# EAGLE schematic SmartThermo2.2 (EAGLE 8.4.0)
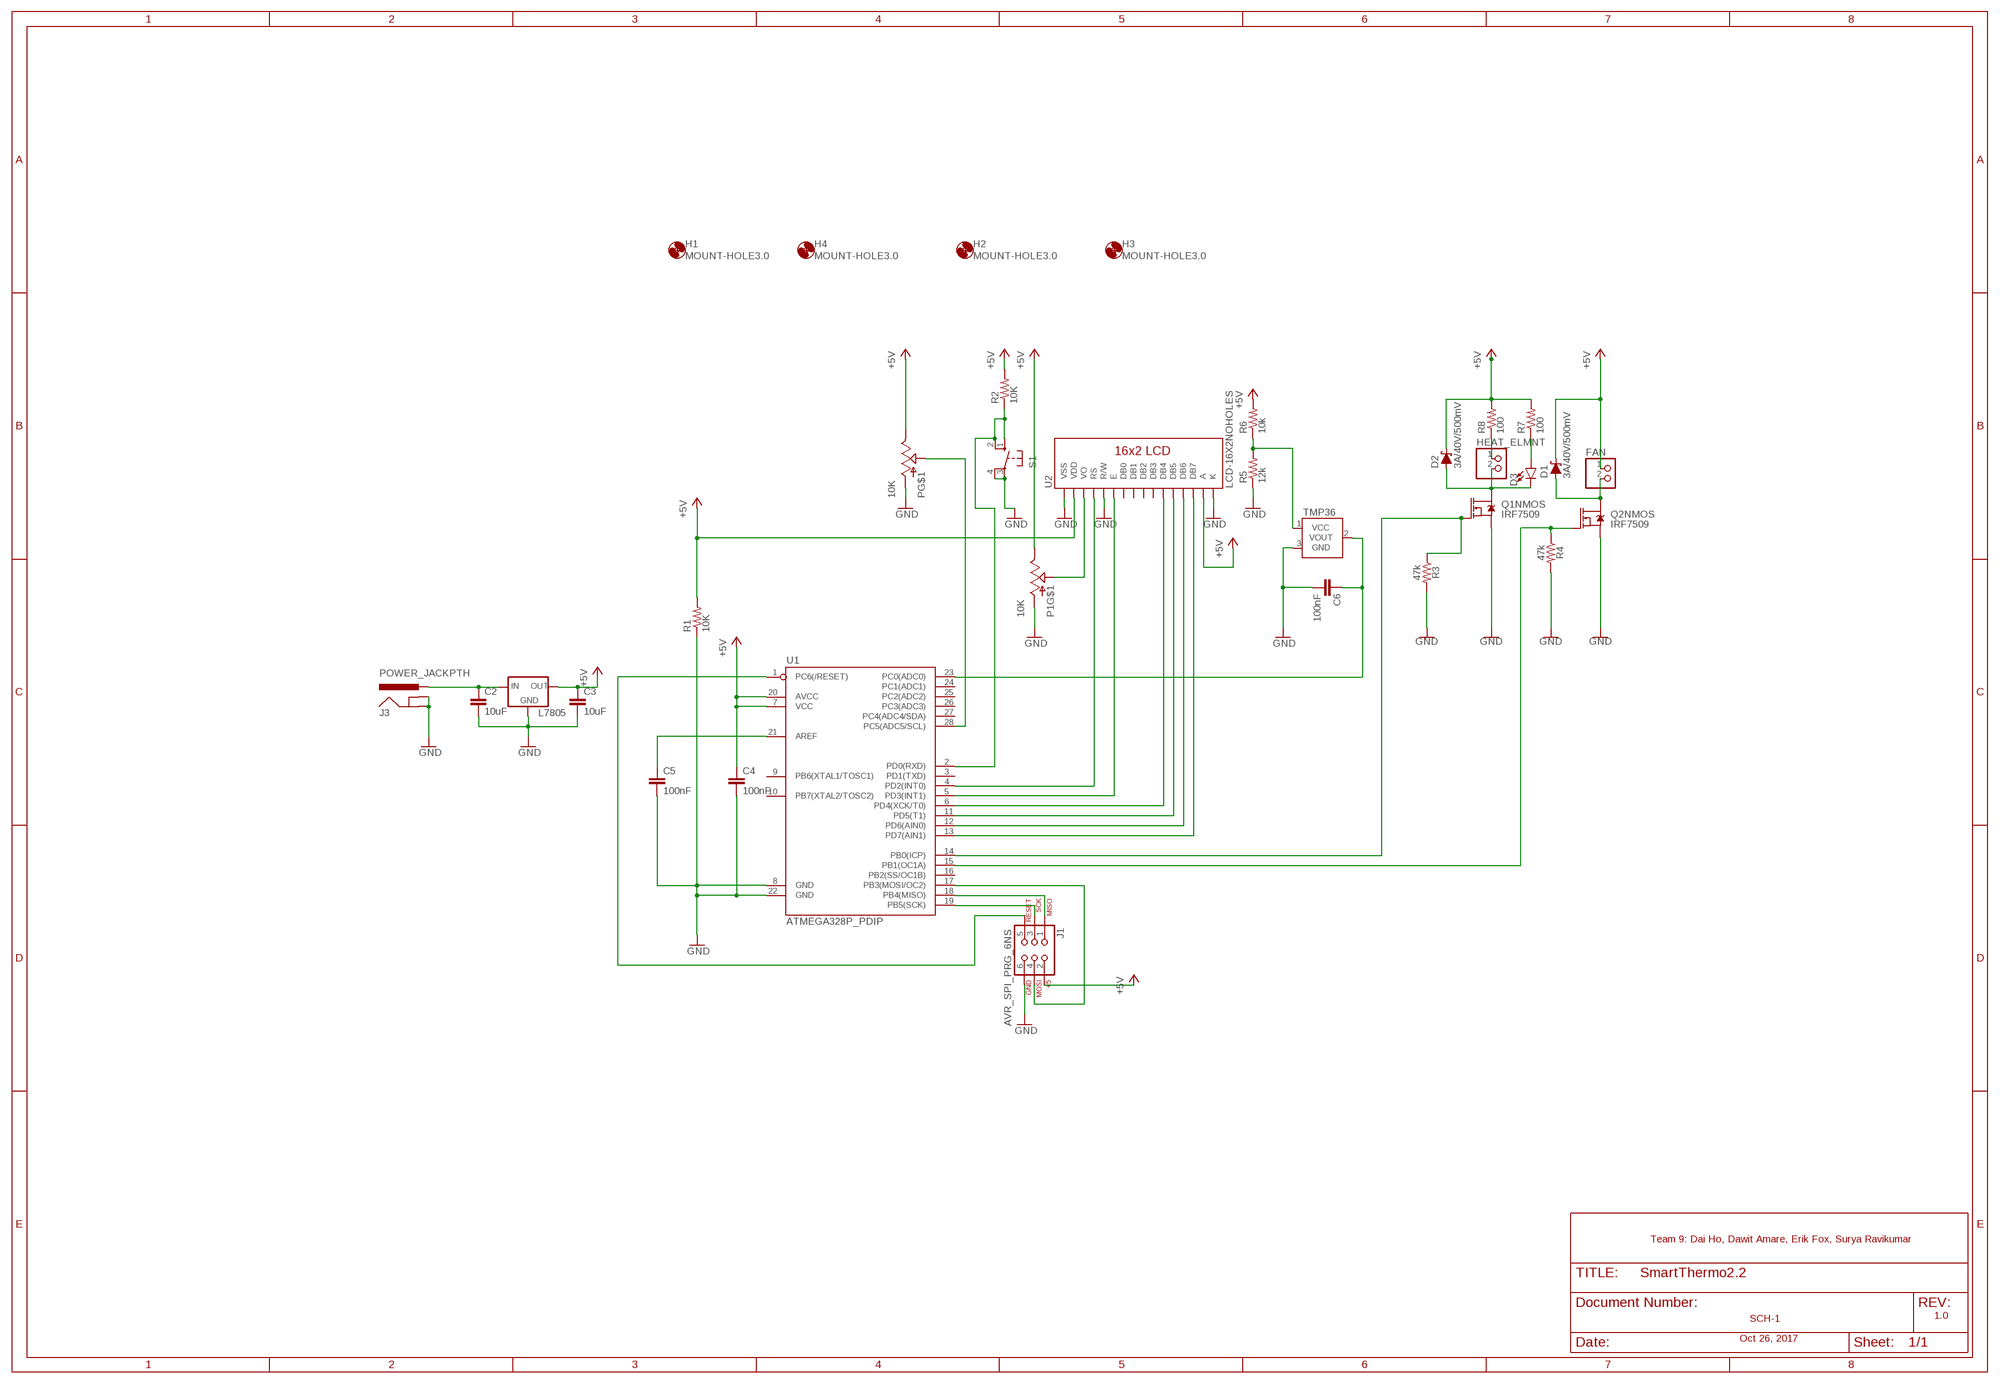
[diagram p0: schematic, sheet 1]

## Parts
C2  10uF  C7.5/3  [C7.5B3]
C3  10uF  C7.5/3  [C7.5B3]
C4  100nF  C2.5/2  [C2.5-2]
C5  100nF  C2.5/2  [C2.5-2]
C6  100nF  C2.5/2  [C2.5-2]
D1  3A/40V/500mV  DIODE-SCHOTTKY-B340A  [SMA-DIODE]
D2  3A/40V/500mV  DIODE-SCHOTTKY-B340A  [SMA-DIODE]
D3  LED3MM  [LED_3MM]
FAN  PINHD-1X2/90  [1X02/90]
H1  MOUNT-HOLE3.0  [3,0]
H2  MOUNT-HOLE3.0  [3,0]
H3  MOUNT-HOLE3.0  [3,0]
H4  MOUNT-HOLE3.0  [3,0]
HEAT_ELMNT  PINHD-1X2/90  [1X02/90]
J1  AVR_SPI_PRG_6NS  [2X3-NS]
J3  POWER_JACKPTH  [POWER_JACK_PTH]
L7805  78XXL  [78XXL]
P  10K  POT_SWITCHPOT_PTH  [POT_PTH]
P1  10K  POT_SWITCHPOT_PTH  [POT_PTH]
Q1  IRF7509  [MSOP8]
Q2  IRF7509  [MSOP8]
R1  10K  RESISTOR1206  [1206]
R2  10K  RESISTOR1206  [1206]
R3  47k  47KOHM-0603-1/10W-1%  [0603]
R4  47k  47KOHM-0603-1/10W-1%  [0603]
R5  12k  R-US_0204/5  [0204/5]
R6  10k  R-US_0204/5  [0204/5]
R7  100  R-US_0204/5  [0204/5]
R8  100  R-US_0204/5  [0204/5]
S1  10-XX  [B3F-10XX]
TMP36  TMP36GT9  [TO-92]
U1  ATMEGA328P_PDIP  [DIL28-3]
U2  LCD-16X2NOHOLES  [LCD-16X2_NOHOLES]

## Nets
+5V: C3.1 C4.1 D1.C D2.C FAN.1 J1.2 L7805.OUT P1.E@2(E) P.E@2(E) R1.2 R2.2 R6.2 R7.2 R8.2 U1.7(VCC) U1.20(AVCC) U2.2(VDD) U2.15(A)
GND: C2.2 C3.2 C4.2 C5.2 C6.2 J1.6 J3.GND J3.GNDBREAK L7805.GND P1.E@1(A) P.E@1(A) Q1.1(NMOS:S) Q2.1(NMOS:S) R1.1 R3.2 R4.2 R5.1 S1.3(P) S1.4(P1) TMP36.3(GND) U1.8(GND) U1.22(GND) U2.1(VSS) U2.5(R/W) U2.16(K)
N$2: C6.1 TMP36.2(VOUT) U1.23(PC0(ADC0))
N$3: P.WAND(S) U1.28(PC5(ADC5/SCL))
N$4: Q2.2(NMOS:G) R4.1 U1.15(PB1(OC1A))
N$5: U1.4(PD2(INT0)) U2.4(RS)
N$6: P1.WAND(S) U2.3(VO)
N$7: U1.5(PD3(INT1)) U2.6(E)
N$8: U1.6(PD4(XCK/T0)) U2.11(DB4)
N$9: U1.11(PD5(T1)) U2.12(DB5)
N$10: U1.12(PD6(AIN0)) U2.13(DB6)
N$11: U1.13(PD7(AIN1)) U2.14(DB7)
N$12: C2.1 J3.PWR L7805.IN
N$13: D1.A FAN.2 Q2.7(NMOS:D) Q2.8(NMOS:D)
N$14: R5.2 R6.1 TMP36.1(VCC)
N$15: R2.1 S1.1(S) S1.2(S1) U1.2(PD0(RXD))
N$16: J1.1 U1.18(PB4(MISO))
N$17: HEAT_ELMNT.1 R8.1
N$18: J1.4 U1.17(PB3(MOSI/OC2))
N$19: Q1.2(NMOS:G) R3.1 U1.14(PB0(ICP))
N$20: J1.3 U1.19(PB5(SCK))
N$21: D2.A D3.K(C) HEAT_ELMNT.2 Q1.7(NMOS:D) Q1.8(NMOS:D)
N$26: C5.1 U1.21(AREF)
N$42: J1.5 U1.1(PC6(/RESET))
N$43: D3.A R7.1
Unconnected: P1.S1 P1.S2 P.S1 P.S2 Q1.3(PMOS:S) Q1.4(PMOS:G) Q1.5(PMOS:D) Q1.6(PMOS:D) Q2.3(PMOS:S) Q2.4(PMOS:G) Q2.5(PMOS:D) Q2.6(PMOS:D) U1.3(PD1(TXD)) U1.9(PB6(XTAL1/TOSC1)) U1.10(PB7(XTAL2/TOSC2)) U1.16(PB2(SS/OC1B)) U1.24(PC1(ADC1)) U1.25(PC2(ADC2)) U1.26(PC3(ADC3)) U1.27(PC4(ADC4/SDA)) U2.7(DB0) U2.8(DB1) U2.9(DB2) U2.10(DB3)

## Notes on the sheet
- Team 9: Dai Ho, Dawit Amare, Erik Fox, Surya Ravikumar
- 1.0
- SCH-1
- Oct 26, 2017

## Library data of the parts
C2-C6 = capacitor-wima:C: CAPACITOR naming: grid - package width
D1 D2 = SparkFun-DiscreteSemi:DIODE-SCHOTTKY: Schottky diode A Schottky diode is a semiconductor diode which has a low forward voltage drop and a very fast switching action.; PROD_ID: DIO-09886
D3 = SparkFun-LED:LED: LED (Generic) Standard schematic elements and footprints for 5mm, 3mm, 1206, and 0603 sized LEDs. Generic LEDs with no color specified.; PROD_ID: DIO-08794
FAN HEAT_ELMNT = pinhead:PINHD-1X2: PIN HEADER
H1-H4 = holes:MOUNT-HOLE: MOUNTING HOLE with drill center marker
J1 = SparkFun-Connectors:AVR_SPI_PRG_6: AVR ISP 6 Pin This is the reduced ISP connector for AVR programming. Common on Arduino. This footprint will take up less PCB space and can be used with a 10-pin to 6-pin adapter such as SKU: BOB-08508 **Special note about "TEST_POINT" package. The stop mask is on the top side, so if you want your programming test points to be on the bottom of your board, make sure to place this package on the bottom side of the board. This also ensure that the orientation to program from the bottom side will be correct.
J3 = SparkFun-Connectors:POWER_JACK: Power Jack This is the standard 5.5mm barrel jack for power. The PTH is the most common, proven, reliable, footprint. The Slot footprint only works if the mill layer is transmitted to the PCB fab house so be warned. Mating wall wart : TOL-00298 (and others); PROD_ID: CONN-08197
L7805 = v-reg:78XXL: VOLTAGE REGULATOR
P P1 = button_TestFootprint:POT_SWITCH: Potentiometer w/ switch.
Q1 Q2 = SparkFun-DiscreteSemi:IRF7509: Dual N and P Channel MOSFET Dual N/P-Channel 30V 1.25 W 7.8/7.5 nC Hexfet Power Mosfet Surface Mount-MICRO-8. NMOS RDS(ON) 0.11Ω. PMOS RDS(ON) 0.20Ω. Link to datasheet <http://www.irf.com/product-info/datasheets/data/irf7509pbf.pdf> SparkFun Products: SparkFun RedBot Mainboard <https://www.sparkfun.com/products/12097> SparkFun Wake on Shake <https://www.sparkfun.com/products/11447>; PROD_ID: TRANS-07913
R1 R2 = SparkFun-Passives:RESISTOR: Resistor Basic schematic elements and footprints for 0603, 1206, and PTH resistors.
R3 R4 = SparkFun-Resistors:47KOHM: 47kΩ resistor A resistor is a passive two-terminal electrical component that implements electrical resistance as a circuit element. Resistors act to reduce current flow, and, at the same time, act to lower voltage levels within circuits. - Wikipedia; PROD_ID: RES-07871
R5-R8 = resistor:R-US_: RESISTOR, American symbol
S1 = switch-omron:10-XX: OMRON SWITCH; MPN: B3F-1000; OC_FARNELL: 176432; OC_NEWARK: 36M3542
TMP36 = SparkFun-Sensors:TMP36: Precision degC temp sensor, analog out
U1 = SparkFun-DigitalIC:ATMEGA328P_PDIP: uC used in the Arduino 32kb flash, 1k EEPROM, 2k SRAM This is the through-hole version of this chip.
U2 = SparkFun-Displays:LCD-16X2: Standard text-only 16x2 parallel input LCD

## Net classes
0 default: clearance 0.205 mm